# Altium project USBtoUART R.PrjPCB
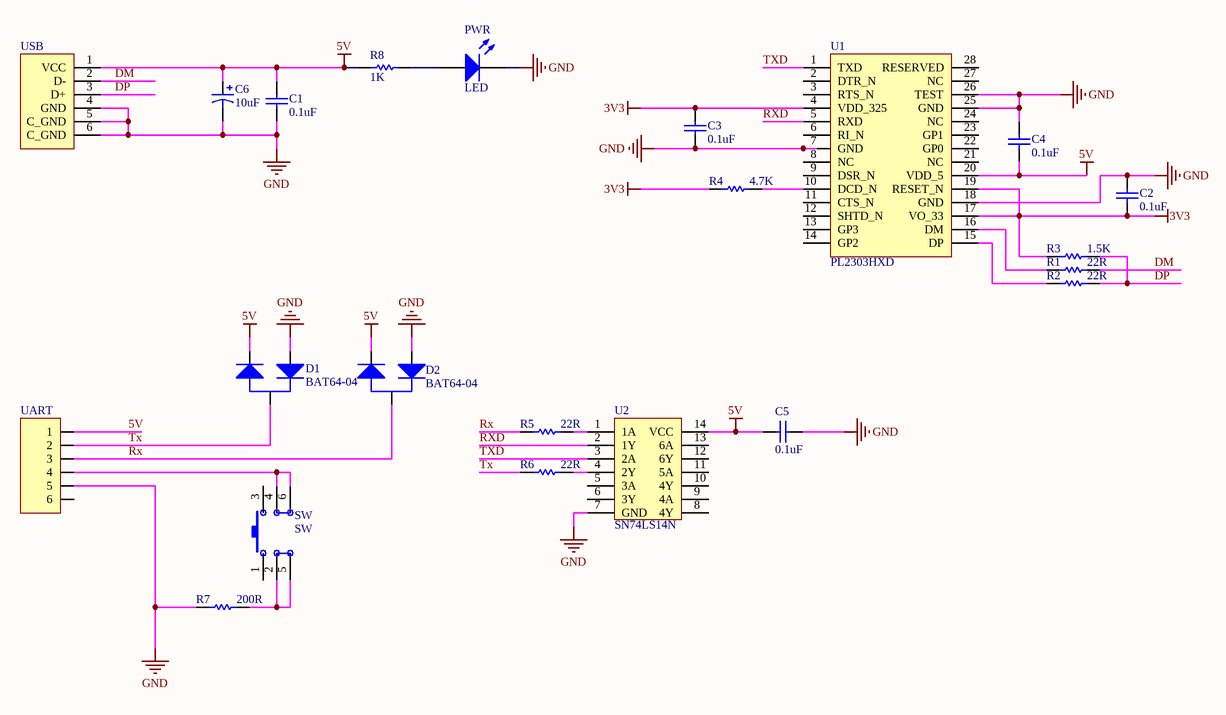
[diagram p0: USBtoUART R.SchDoc]
1 sheet, 22 parts. Net scope: global (net labels, ports and power ports of the same name join across sheets).
Board file: USBtoUART R.PcbDoc

## Sheet USBtoUART R.SchDoc
size A4

### Parts
C1  0.1uF  [0603INCH_1608mm]
C2  0.1uF  [0603INCH_1608mm]
C3  0.1uF  [0603INCH_1608mm]
C4  0.1uF  [0603INCH_1608mm]
C5  0.1uF  [0603INCH_1608mm]
C6  10uF  [7343-CAP]
D1  BAT64-04  [SOT23_N]
D2  BAT64-04  [SOT23_N]
PWR  LED  [LED 0805]
R1  22R  [0603INCH_1608mm]
R2  22R  [0603INCH_1608mm]
R3  1.5K  [0603INCH_1608mm]
R4  4.7K  [0603INCH_1608mm]
R5  22R  [0603INCH_1608mm]
R6  22R  [0603INCH_1608mm]
R7  200R  [0603INCH_1608mm]
R8  1K  [0603INCH_1608mm]
SW  SW  [SW_zs]
U1  PL2303HXD  [SOP65P780-28BN]
U2  SN74LS14N  [PDIP_14pin]
UART  DP6  [Pin6_2.54mm]  (value not drawn)
USB  USB  [USB2.5-2H4D]  (value not drawn)

### Nets
3V3: C2.2 C3.2 R3.2 R4.1 U1.4(VDD_325) U1.17(VO_33) U1.19(RESET_N)
5V: C1.2 C4.1 C5.1 C6.1 D1.2 D2.2 R8.1 U1.20(VDD_5) U2.14(VCC) UART.1 USB.1(VCC)
GND: C1.1 C2.1 C3.1 C4.2 C5.2 C6.2 D1.1 D2.1 PWR.K R7.1 U1.7(GND) U1.18(GND) U1.25(GND) U1.26(TEST) U2.7(GND) UART.5 USB.4(GND) USB.5(C_GND) USB.6(C_GND)
DM: R1.2 USB.2(D-)
DP: R2.2 R3.1 USB.3(D+)
Rx: D2.3 R5.1 UART.3
RXD: U1.5(RXD) U2.2(1Y)
Tx: D1.3 R6.1 UART.2
TXD: U1.1(TXD) U2.3(2A)
NetPWR_A: PWR.A R8.2
NetR1_1: R1.1 U1.16(DM)
NetR2_1: R2.1 U1.15(DP)
NetR4_2: R4.2 U1.10(DCD_N)
NetR5_2: R5.2 U2.1(1A)
NetR6_2: R6.2 U2.4(2Y)
NetR7_2: R7.2 SW.2 SW.5
NetSW_4: SW.4 SW.6 UART.4

Not connected (* = marked no-connect by the designer): SW 1 3; U1 2(DTR_N) 3(RTS_N) 6(RI_N) 8(NC) 9(DSR_N) 11(CTS_N) 12(SHTD_N) 13(GP3) 14(GP2) 21(NC) 22(GP0) 23(GP1) 24(NC) 27(NC) 28(RESERVED); U2 5(3A) 6(3Y) 8(4Y) 9(4A) 10(4Y) 11(5A) 12(6Y) 13(6A); UART 6

### Library data of the parts
C1-C5 = Cap: Value: 100pF
C6 = Cap_Pol: Value: 100pF
R1-R7 = Res: Value: 1K
R8 = Res: Value: 1K
SW = SW_zs5.8
U2 = 74HC14D